# EAGLE schematic LoRa_Transmitter (EAGLE 9.6.2)
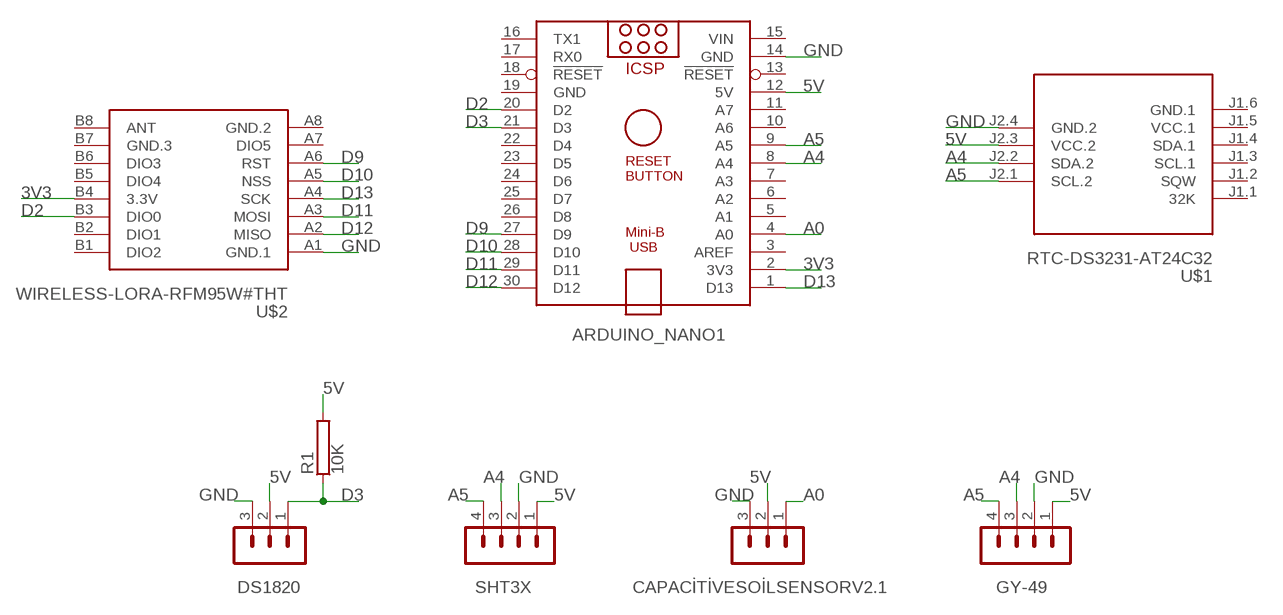
[diagram p0: schematic, sheet 1]

## Parts
ARDUINO_NANO1  ARDUINO_NANO  [ARDUINO_NANO]
CAPACİTİVESOİLSENSORV2.1  MA03-1  [MA03-1]
DS1820  MA03-1  [MA03-1]
GY-49  MA04-1  [MA04-1]
R1  10K  RMG100-V  [TO-247-2V]
SHT3X  MA04-1  [MA04-1]
U$1  RTC-DS3231-AT24C32  [RTC-DS3231-AT24C32]
U$2  WIRELESS-LORA-RFM95W#THT  [WIRELESS-LORA-RFM95W#THT]

## Nets
3V3: ARDUINO_NANO1.2(3V3) U$2.B4(3.3V)
5V: ARDUINO_NANO1.12(5V) CAPACİTİVESOİLSENSORV2.1.2 DS1820.2 GY-49.1 R1.2 SHT3X.1 U$1.J2.3(VCC.2)
A0: ARDUINO_NANO1.4(A0) CAPACİTİVESOİLSENSORV2.1.1
A4: ARDUINO_NANO1.8(A4) GY-49.3 SHT3X.3 U$1.J2.2(SDA.2)
A5: ARDUINO_NANO1.9(A5) GY-49.4 SHT3X.4 U$1.J2.1(SCL.2)
D2: ARDUINO_NANO1.20(D2) U$2.B3(DIO0)
D3: ARDUINO_NANO1.21(D3) DS1820.1 R1.1
D9: ARDUINO_NANO1.27(D9) U$2.A6(RST)
D10: ARDUINO_NANO1.28(D10) U$2.A5(NSS)
D11: ARDUINO_NANO1.29(D11) U$2.A3(MOSI)
D12: ARDUINO_NANO1.30(D12) U$2.A2(MISO)
D13: ARDUINO_NANO1.1(D13) U$2.A4(SCK)
GND: ARDUINO_NANO1.14(GND) CAPACİTİVESOİLSENSORV2.1.3 DS1820.3 GY-49.2 SHT3X.2 U$1.J2.4(GND.2) U$2.A1(GND.1)
Unconnected: ARDUINO_NANO1.3(AREF) ARDUINO_NANO1.5(A1) ARDUINO_NANO1.6(A2) ARDUINO_NANO1.7(A3) ARDUINO_NANO1.10(A6) ARDUINO_NANO1.11(A7) ARDUINO_NANO1.13(!RESET) ARDUINO_NANO1.16(TX1) ARDUINO_NANO1.17(RX0) ARDUINO_NANO1.18(!RESET) ARDUINO_NANO1.22(D4) ARDUINO_NANO1.23(D5) ARDUINO_NANO1.24(D6) ARDUINO_NANO1.25(D7) ARDUINO_NANO1.26(D8) U$1.J1.1(32K) U$1.J1.2(SQW) U$1.J1.3(SCL.1) U$1.J1.4(SDA.1) U$2.A7(DIO5) U$2.B1(DIO2) U$2.B2(DIO1) U$2.B5(DIO4) U$2.B6(DIO3) U$2.B8(ANT)

## Power pins joined to a net without a drawn wire
GND: ARDUINO_NANO1.19(GND)
GND.1: U$1.J1.6(GND.1)
GND.2: U$2.A8(GND.2)
GND.3: U$2.B7(GND.3)
VCC.1: U$1.J1.5(VCC.1)
VIN: ARDUINO_NANO1.15(VIN)

## Library data of the parts
ARDUINO_NANO1 = ArduinoNanoV30:ARDUINO_NANO: Arduino Nano V3.0 Overview: The Arduino Nano is a small, complete, and breadboard-friendly board based on the ATmega328 (Arduino Nano 3.x) or ATmega168 (Arduino Nano 2.x). It has more or less the same functionality of the Arduino Duemilanove, but in a different package. It lacks only a DC power jack, and works with a Mini-B USB cable instead of a standard one. The Nano was designed and is being produced by Gravitech. Specifications: Microcontroller Atmel ATmega168 or ATmega328 Operating Voltage (logic level) 5 V Input Voltage (recommended) 7-12 V Input Voltage (limits) 6-20 V Digital I/O Pins 14 (of which 6 provide PWM output) Analog Input Pins 8 DC Current per I/O Pin 40 mA Flash Memory 16 KB (ATmega168) or 32 KB (ATmega328) of which 2 KB used by bootloader SRAM 1 KB (ATmega168) or 2 KB (ATmega328) EEPROM 512 bytes (ATmega168) or 1 KB (ATmega328) Clock Speed 16 MHz Dimensions 0.73" x 1.70" Length 45 mm Width 18 mm Weigth 5 g Power: The Arduino Nano can be powered via the Mini-B USB connection, 6-20V unregulated external power supply (pin 30), or 5V regulated external power supply (pin 27). The power source is automatically selected to the highest voltage source. Memory: The ATmega168 has 16 KB of flash memory for storing code (of which 2 KB is used for the bootloader); the ATmega328 has 32 KB, (also with 2 KB used for the bootloader). The ATmega168 has 1 KB of SRAM and 512 bytes of EEPROM (which can be read and written with the EEPROM library); the ATmega328 has 2 KB of SRAM and 1 KB of EEPROM. Input and Output: Each of the 14 digital pins on the Nano can be used as an input or output, using pinMode(), digitalWrite(), and digitalRead() functions. They operate at 5 volts. Each pin can provide or receive a maximum of 40 mA and has an internal pull-up resistor (disconnected by default) of 20-50 kOhms. In addition, some pins have specialized functions. Visit Arduino - ArduinoBoardNano <https://www.arduino.cc/en/Main/ArduinoBoardNano>
CAPACİTİVESOİLSENSORV2.1 DS1820 = con-lstb:MA03-1: PIN HEADER; OC_FARNELL: unknown; OC_NEWARK: unknown
GY-49 SHT3X = con-lstb:MA04-1: PIN HEADER; OC_FARNELL: unknown; OC_NEWARK: unknown
R1 = resistor-power:RMG100: TO-247 Power Resistor - RMG 100 Series Source: www.token.com.tw .. power-resistor-rmg100pdf; OC_FARNELL: unknown; OC_NEWARK: unknown
U$1 = ds3231:RTC-DS3231-AT24C32: RTC Module with Battery and EEPROM based on DS3231 and AT24C32 chips Tutorial can be found here: https://edwardmallon.wordpress.com/2014/05/21/using-a-cheap-3-ds3231-rtc-at24c32-eeprom-from-ebay/ Click here to find device on ebay.com <http://www.ebay.com/sch/DS3231+AT24C32+module>
U$2 = diy-modules:WIRELESS-LORA-RFM95W: 868/915 MHz LoRa Radio Transceiver Module based on SX1276 chip Click here to find device on ebay.com <http://www.ebay.com/sch/RFM95W+transceiver>